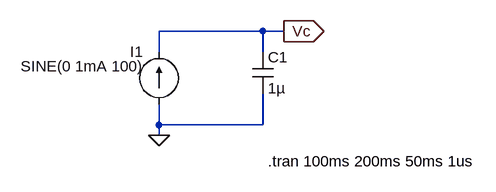
[diagram p0: schematic RC Wave.asc]
RC Wave.asc, the LTspice schematic file:
Version 4
SHEET 1 880 680
WIRE 288 256 128 256
WIRE 320 256 288 256
WIRE 128 288 128 256
WIRE 288 288 288 256
WIRE 128 400 128 368
WIRE 288 400 288 352
WIRE 288 400 128 400
WIRE 128 416 128 400
FLAG 128 416 0
FLAG 320 256 Vc
IOPIN 320 256 Out
SYMBOL current 128 368 R180
WINDOW 0 24 80 Left 2
WINDOW 3 24 58 Left 2
SYMATTR InstName I1
SYMATTR Value SINE(0 1mA 100)
SYMBOL cap 272 288 R0
SYMATTR InstName C1
SYMATTR Value 1µ
TEXT 296 456 Left 2 !.tran 100ms 200ms 50ms 1us

The netlist it stands for:
* RC Wave.asc
I1 0 Vc SINE(0 1mA 100)
C1 Vc 0 1µ
.tran 100ms 200ms 50ms 1us
.backanno
.end